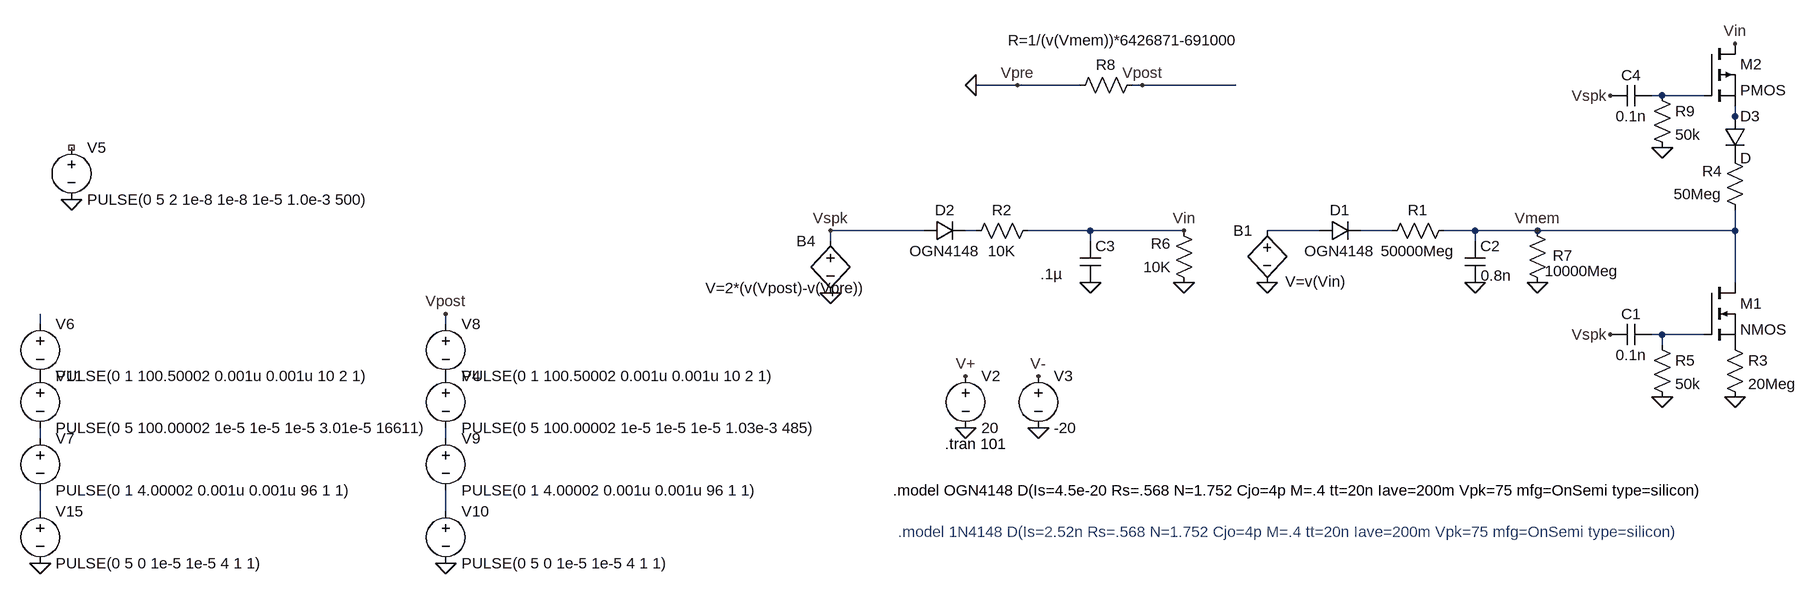
[diagram p0: schematic SynapseModModded.asc]
SynapseModModded.asc, the LTspice schematic file:
Version 4
SHEET 1 2576 1172
WIRE 240 416 176 416
WIRE 336 416 240 416
WIRE 432 416 416 416
WIRE 576 416 432 416
WIRE 1232 432 1216 432
WIRE 1296 432 1232 432
WIRE 1344 464 1344 448
WIRE 1344 480 1344 464
WIRE 96 640 -48 640
WIRE 176 640 160 640
WIRE 352 640 256 640
WIRE 496 640 352 640
WIRE 704 640 624 640
WIRE 816 640 768 640
WIRE 944 640 896 640
WIRE 1040 640 944 640
WIRE 1344 640 1344 608
WIRE 1344 640 1040 640
WIRE -48 656 -48 640
WIRE 352 656 352 640
WIRE 944 656 944 640
WIRE 1344 720 1344 640
WIRE -1264 784 -1264 768
WIRE -640 784 -640 768
WIRE 1232 800 1216 800
WIRE 1296 800 1232 800
WIRE 1232 816 1232 800
WIRE -1264 960 -1264 944
WIRE -640 960 -640 944
WIRE -1264 1072 -1264 1040
WIRE -640 1072 -640 1040
FLAG 160 944 0
FLAG 272 944 0
FLAG 160 864 V+
FLAG 272 864 V-
FLAG 1040 640 Vmem
FLAG 1040 720 0
FLAG 944 720 0
FLAG -48 736 0
FLAG 432 416 Vpost
FLAG -1216 592 0
FLAG 352 720 0
FLAG 496 720 0
FLAG -640 1152 0
FLAG 624 720 0
FLAG 496 640 Vin
FLAG -1264 1152 0
FLAG 1344 896 0
FLAG -48 640 Vspk
FLAG 1152 800 Vspk
FLAG 1344 352 Vin
FLAG 1232 896 0
FLAG 1152 432 Vspk
FLAG 1232 512 0
FLAG 176 416 0
FLAG -640 768 Vpost
FLAG 240 416 Vpre
SYMBOL voltage 160 848 R0
WINDOW 123 0 0 Left 2
WINDOW 39 0 0 Left 2
SYMATTR InstName V2
SYMATTR Value 20
SYMBOL voltage 272 848 R0
WINDOW 123 0 0 Left 2
WINDOW 39 0 0 Left 2
SYMATTR InstName V3
SYMATTR Value -20
SYMBOL res 512 736 R180
WINDOW 0 36 76 Left 2
WINDOW 3 36 40 Left 2
SYMATTR InstName R6
SYMATTR Value 10K
SYMBOL cap 928 656 R0
WINDOW 3 25 53 Left 2
SYMATTR Value 0.8n
SYMATTR InstName C2
SYMATTR SpiceLine V=16 Irms=7.41 Rser=0.000 Lser=0
SYMBOL res 1056 736 R180
WINDOW 0 -38 58 Left 2
WINDOW 3 -110 34 Left 2
SYMATTR InstName R7
SYMATTR Value 10000Meg
SYMBOL bv -48 640 R0
WINDOW 0 -52 16 Left 2
WINDOW 3 -192 88 Left 2
SYMATTR InstName B4
SYMATTR Value V=2*(v(Vpost)-v(Vpre))
SYMBOL res 432 400 R90
WINDOW 0 0 56 VBottom 2
WINDOW 3 -69 27 VTop 2
SYMATTR InstName R8
SYMATTR Value R=1/(v(Vmem))*6426871-691000
SYMBOL voltage -1216 496 R0
WINDOW 123 0 0 Left 2
WINDOW 39 0 0 Left 2
SYMATTR InstName V5
SYMATTR Value PULSE(0 5 2 1e-8 1e-8 1e-5 1.0e-3 500)
SYMBOL res 912 624 R90
WINDOW 0 0 56 VBottom 2
WINDOW 3 32 56 VTop 2
SYMATTR InstName R1
SYMATTR Value 50000Meg
SYMBOL cap 336 656 R0
WINDOW 3 -61 51 Left 2
SYMATTR Value .1µ
SYMATTR InstName C3
SYMATTR SpiceLine V=16 Irms=7.41 Rser=0.000 Lser=0
SYMBOL diode 96 656 R270
WINDOW 0 32 32 VTop 2
WINDOW 3 0 32 VBottom 2
SYMATTR InstName D2
SYMATTR Value OGN4148
SYMBOL voltage -640 848 R0
WINDOW 123 0 0 Left 2
WINDOW 39 0 0 Left 2
SYMATTR InstName V4
SYMATTR Value PULSE(0 5 100.00002 1e-5 1e-5 1e-5 1.03e-3 485)
SYMBOL voltage -640 768 R0
WINDOW 123 0 0 Left 2
WINDOW 39 0 0 Left 2
SYMATTR InstName V8
SYMATTR Value PULSE(0 1 100.50002 0.001u 0.001u 10 2 1)
SYMBOL voltage -640 944 R0
WINDOW 123 0 0 Left 2
WINDOW 39 0 0 Left 2
SYMATTR InstName V9
SYMATTR Value PULSE(0 1 4.00002 0.001u 0.001u 96 1 1)
SYMBOL voltage -640 1056 R0
WINDOW 123 0 0 Left 2
WINDOW 39 0 0 Left 2
SYMATTR InstName V10
SYMATTR Value PULSE(0 5 0 1e-5 1e-5 4 1 1)
SYMBOL res 272 624 R90
WINDOW 0 0 56 VBottom 2
WINDOW 3 32 56 VTop 2
SYMATTR InstName R2
SYMATTR Value 10K
SYMBOL voltage -1264 848 R0
WINDOW 123 0 0 Left 2
WINDOW 39 0 0 Left 2
SYMATTR InstName V11
SYMATTR Value PULSE(0 5 100.00002 1e-5 1e-5 1e-5 3.01e-5 16611)
SYMBOL bv 624 624 R0
WINDOW 0 -52 16 Left 2
WINDOW 3 28 94 Left 2
SYMATTR InstName B1
SYMATTR Value V=v(Vin)
SYMBOL diode 704 656 R270
WINDOW 0 32 32 VTop 2
WINDOW 3 0 32 VBottom 2
SYMATTR InstName D1
SYMATTR Value OGN4148
SYMBOL voltage -1264 768 R0
WINDOW 123 0 0 Left 2
WINDOW 39 0 0 Left 2
SYMATTR InstName V6
SYMATTR Value PULSE(0 1 100.50002 0.001u 0.001u 10 2 1)
SYMBOL voltage -1264 944 R0
WINDOW 123 0 0 Left 2
WINDOW 39 0 0 Left 2
SYMATTR InstName V7
SYMATTR Value PULSE(0 1 4.00002 0.001u 0.001u 96 1 1)
SYMBOL voltage -1264 1056 R0
WINDOW 123 0 0 Left 2
WINDOW 39 0 0 Left 2
SYMATTR InstName V15
SYMATTR Value PULSE(0 5 0 1e-5 1e-5 4 1 1)
SYMBOL nmos 1296 720 R0
SYMATTR InstName M1
SYMBOL res 1328 800 R0
SYMATTR InstName R3
SYMATTR Value 20Meg
SYMBOL res 1360 624 R180
WINDOW 0 36 76 Left 2
WINDOW 3 36 40 Left 2
SYMATTR InstName R4
SYMATTR Value 50Meg
SYMBOL pmos 1296 352 R0
SYMATTR InstName M2
SYMBOL diode 1328 464 R0
SYMATTR InstName D3
SYMBOL cap 1216 784 R90
WINDOW 0 0 32 VBottom 2
WINDOW 3 32 32 VTop 2
SYMATTR InstName C1
SYMATTR Value 0.1n
SYMBOL res 1216 800 R0
SYMATTR InstName R5
SYMATTR Value 50k
SYMBOL cap 1216 416 R90
WINDOW 0 0 32 VBottom 2
WINDOW 3 32 32 VTop 2
SYMATTR InstName C4
SYMATTR Value 0.1n
SYMBOL res 1216 416 R0
SYMATTR InstName R9
SYMATTR Value 50k
TEXT 128 968 Left 2 !.tran 101
TEXT 48 1040 Left 2 !.model OGN4148 D(Is=4.5e-20 Rs=.568 N=1.752 Cjo=4p M=.4 tt=20n Iave=200m Vpk=75 mfg=OnSemi type=silicon)
TEXT 56 1104 Left 2 ;.model 1N4148 D(Is=2.52n Rs=.568 N=1.752 Cjo=4p M=.4 tt=20n Iave=200m Vpk=75 mfg=OnSemi type=silicon)

The netlist it stands for:
* SynapseModModded.asc
V2 V+ 0 20
V3 V- 0 -20
R6 0 Vin 10K
C2 Vmem 0 0.8n V=16 Irms=7.41 Rser=0.000 Lser=0
R7 0 Vmem 10000Meg
B4 Vspk 0 V=2*(v(Vpost)-v(Vpre))
R8 Vpost 0 R=1/(v(Vmem))*6426871-691000
V5 NC_01 0 PULSE(0 5 2 1e-8 1e-8 1e-5 1.0e-3 500)
R1 Vmem N005 50000Meg
C3 Vin 0 .1µ V=16 Irms=7.41 Rser=0.000 Lser=0
D2 Vspk N003 OGN4148
V4 P001 N009 PULSE(0 5 100.00002 1e-5 1e-5 1e-5 1.03e-3 485)
V8 Vpost P001 PULSE(0 1 100.50002 0.001u 0.001u 10 2 1)
V9 N009 N011 PULSE(0 1 4.00002 0.001u 0.001u 96 1 1)
V10 N011 0 PULSE(0 5 0 1e-5 1e-5 4 1 1)
R2 Vin N003 10K
V11 P002 N008 PULSE(0 5 100.00002 1e-5 1e-5 1e-5 3.01e-5 16611)
B1 N004 0 V=v(Vin)
D1 N004 N005 OGN4148
V6 N006 P002 PULSE(0 1 100.50002 0.001u 0.001u 10 2 1)
V7 N008 N010 PULSE(0 1 4.00002 0.001u 0.001u 96 1 1)
V15 N010 0 PULSE(0 5 0 1e-5 1e-5 4 1 1)
M1 Vmem N007 P003 P003 NMOS
R3 P003 0 20Meg
R4 Vmem P004 50Meg
M2 Vin N001 N002 N002 PMOS
D3 N002 P004 D
C1 N007 Vspk 0.1n
R5 N007 0 50k
C4 N001 Vspk 0.1n
R9 N001 0 50k
.model D D
.lib standard.dio
.model NMOS NMOS
.model PMOS PMOS
.lib standard.mos
.tran 101
.model OGN4148 D(Is=4.5e-20 Rs=.568 N=1.752 Cjo=4p M=.4 tt=20n Iave=200m Vpk=75 mfg=OnSemi type=silicon)
* .model 1N4148 D(Is=2.52n Rs=.568 N=1.752 Cjo=4p M=.4 tt=20n Iave=200m Vpk=75 mfg=OnSemi type=silicon)
.backanno
.end